# Altium schematic sheet GNSS Antenna.SchDoc: GNSS Antenna & LNA
size 292 x 193 mm; SheetNumber: 35; SheetTotal: 40
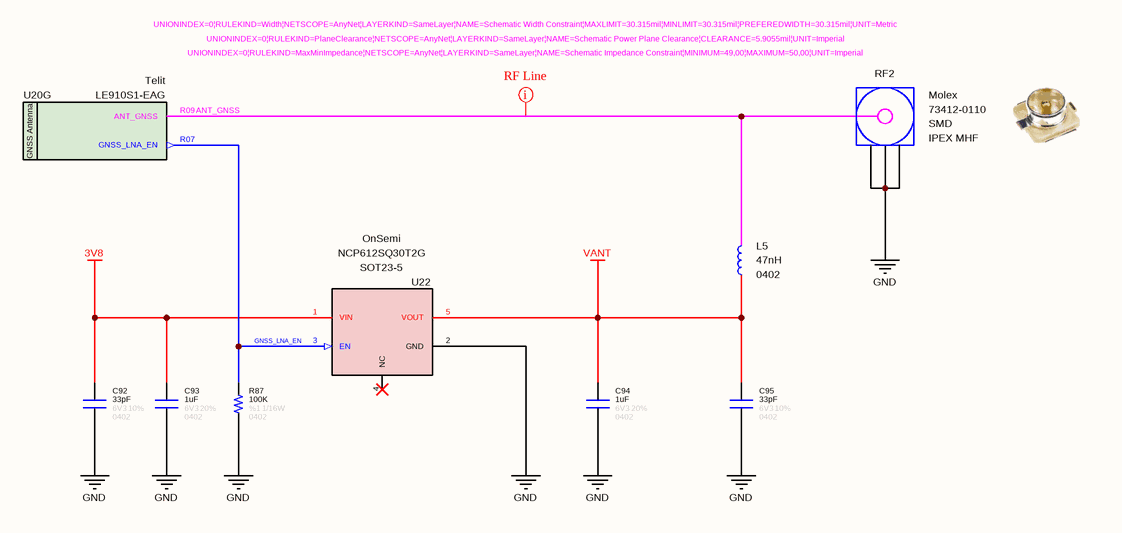
[diagram p0: GNSS Antenna.SchDoc]

## Parts
C92  value 33pF  Tolerance: 10%  Case: 0402  Voltage: 6V3  [CAPACITOR_0402]  (hidden comment: Capacitor - 33pF [0402] (Ceramic))
C93  value 1uF  Tolerance: 20%  Case: 0402  Voltage: 6V3  [CAPACITOR_0402]  (hidden comment: Capacitor - 1uF [0402] (Ceramic))
C94  value 1uF  Tolerance: 20%  Case: 0402  Voltage: 6V3  [CAPACITOR_0402]  (hidden comment: Capacitor - 1uF [0402] (Ceramic))
C95  value 33pF  Tolerance: 10%  Case: 0402  Voltage: 6V3  [CAPACITOR_0402]  (hidden comment: Capacitor - 33pF [0402] (Ceramic))
L5  value 47nH  Case: 0402  [INDUCTOR_0603]  (hidden comment: RF Inductors - SMD)
R87  value 100K  Tolerance: %1  Case: 0402  Power: 1/16W  [RESISTOR_0402]  (hidden comment: 100K - 0402 - %1 - 1/16W)
RF2  Connector Type: IPEX MHF  Case: SMD  Manufacturer Name: Molex  [Connector_IPEX]  (hidden comment: 73412-0110)
U20  Manufacturer Part Number: LE910S1-EAG  Manufacturer Name: Telit  [LE910 GSM Modem]  (hidden comment: LE910S1-EAG LTE GSM Module)  (part G of 19)
U22  Manufacturer Name: OnSemi  Case: SOT23-5  [SOT-23-5]  (hidden comment: NCP612SQ30T2G)

## Nets
3V8: C92.2 C93.2 U22.1(VIN)
GND: C92.1 C93.1 C94.1 C95.1 R87.1 RF2.2(GND) RF2.3(GND) RF2.4(GND) U22.2(GND)
VANT: C94.2 C95.2 L5.1 U22.5(VOUT)
ANT_GNSS: L5.2 RF2.1(Signal) U20.R09(ANT_GNSS)
GNSS_LNA_EN: R87.2 U20.R07(GNSS_LNA_EN) U22.3(EN)

Not connected (* = marked no-connect by the designer): U22 4(NC)

## Layout directives
rule Impedance Constraint [Min = 49.00    Max = 50.00    ]; rule Power Plane Clearance [Clearance = 5.906mil]; rule Width Constraint [Pref Width = 0.77mm    Min Width = 0.77mm    Max Width = 0.77mm]: ANT_GNSS

## Notes on the sheet
- © 2021 All rights reserved.
  This document may not, in whole or in part, be copied, photocopied, reproduced, translated or converted to any electronic or machine readable from without prior written permission of Mehmet Günce Akkoyun.
  Engineer contact : akkoyun@me.com
- Property of
- Engineer :
- Date :
- Size :
- A4
- Time :
- Project :
- Page :
- /
- Customer :
- Product ID :
- Module ID :
- Version :
- File :
- Revision :
- (in symbol IC - LE910S1-EAG, part G) GNSS Antenna

## Library data of the parts
C92 C95 = Capacitor - 33pF [0402-6V3]: Manufacturer Name: Kemet; Manufacturer Part Number: C0402C330J9RACAUTO; ComponentLink1Description: DataSheet; ComponentLink1URL: https://api.kemet.com/component-edge/download/datasheet/C0402C330J9RACAUTO.pdf; ComponentLink2Description: Mouser; ComponentLink2URL: https://www.mouser.com/Search/Refine.aspx?Keyword=80-C0402C330J9RAUTO
C93 C94 = Capacitor - 1uF [0402-6V3]: Multilayer Ceramic Capacitors - SMD - 6.3V 1uF X5R 0402 20%; Manufacturer Part Number: GRM153R60J105ME95D; Manufacturer Name: Murata
L5 = Inductor - LQW15AN47NG00D: RF Inductors - SMD 47 NH 2%; Manufacturer Name: Murata Electronics; Height: 0.5mm; Manufacturer Part Number: LQW15AN47NG00D; Tolerance: 2%; ComponentLink1Description: DataSheet; ComponentLink1URL: https://www.mouser.com.tr/datasheet/2/281/JELF243B-0009-1699631.pdf
R87 = Resistor - 100K [0402]: Thick Film Resistors - SMD 1/16 W 100 KOhm 1%; Manufacturer Name: Vishay; Manufacturer Part Number: CRCW0402100KFKED; ComponentLink1Description: DataSheet; ComponentLink1URL: https://www.mouser.com.tr/datasheet/2/427/dcrcwe3-1762152.pdf; ComponentLink2Description: Mouser; ComponentLink2URL: https://www.mouser.com.tr/ProductDetail/Vishay-Dale/CRCW040210K0FKED?qs=sGAEpiMZZMu61qfTUdNhG2DpbjADlD3GcalbOv9utCY%3D
RF2 = Connector - IPEX MHF: MOLEX   73412-0110   RF COAXIAL, MICROCOAXIAL, JACK, 50OHM; ROHS: Yes; Product Type: RF Connectors; Impedance: 50 Ohm; Manufacturer Part Number: 73412-0110
U20 = IC - LE910S1-EAG: Telit LE910S1-EAG GPRS/GNSS Module; Case: BGA
U22 = IC - NCP612SQ30T2G: LDO Voltage Regulators ACMOS1 LDO REGULATOR; RoHS: Yes; Product Type: LDO Voltage Regulators; Manufacturer Part Number: NCP612SQ30T2G